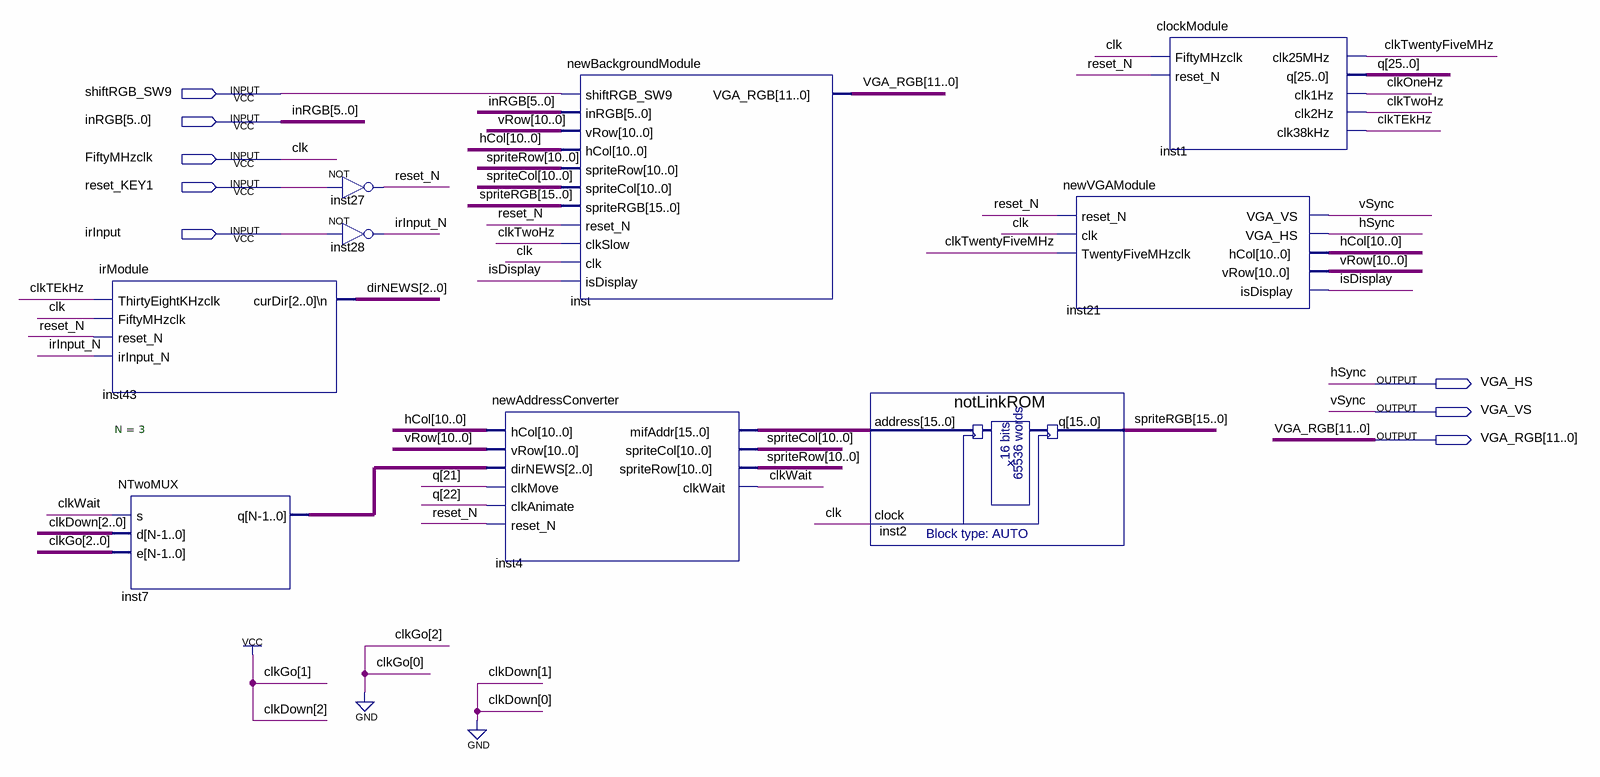
[diagram p0: schematic sheet]
// Quartus schematic DesignProjectFinal.bdf as structural Verilog: 9 symbols, 8 pins
module DesignProjectFinal (
  input  shiftRGB_SW9,
  input  [5:0] inRGB,
  input  FiftyMHzclk,
  input  reset_KEY1,
  input  irInput,
  output VGA_HS,
  output VGA_VS,
  output [11:0] VGA_RGB
);

  wire clkOneHz, clkTEkHz, clkTwentyFiveMHz, clkTwoHz, clkWait, irInput_N, isDisplay, reset_N;
  wire [2:0] dirNEWS, inst7_q;
  wire [10:0] hCol, spriteCol, spriteRow, vRow;
  wire [15:0] inst4_mifaddr, spriteRGB;
  wire [25:0] q;

  irModule inst43 (
    .ThirtyEightKHzclk(clkTEkHz), .FiftyMHzclk(FiftyMHzclk), .reset_N(reset_N), .irInput_N(irInput_N),
    .\curDir[2..0]\n (dirNEWS));
  NTwoMUX #(.N(3)) inst7 (.s(clkWait), .d(3'b100), .e(3'b010), .q(inst7_q));
  not inst27 (reset_N, reset_KEY1);
  not inst28 (irInput_N, irInput);
  newAddressConverter inst4 (
    .hCol(hCol), .vRow(vRow), .dirNEWS(inst7_q), .clkMove(q[21]), .clkAnimate(q[22]), .reset_N(reset_N),
    .mifAddr(inst4_mifaddr), .spriteCol(spriteCol), .spriteRow(spriteRow), .clkWait(clkWait));
  newBackgroundModule inst (
    .shiftRGB_SW9(shiftRGB_SW9), .inRGB(inRGB), .vRow(vRow), .hCol(hCol), .spriteRow(spriteRow),
    .spriteCol(spriteCol), .spriteRGB(spriteRGB), .reset_N(reset_N), .clkSlow(clkTwoHz), .clk(FiftyMHzclk),
    .isDisplay(isDisplay), .VGA_RGB(VGA_RGB));
  notLinkROM inst2 (.address(inst4_mifaddr), .clock(FiftyMHzclk), .q(spriteRGB));
  newVGAModule inst21 (
    .reset_N(reset_N), .clk(FiftyMHzclk), .TwentyFiveMHzclk(clkTwentyFiveMHz), .VGA_VS(VGA_VS),
    .VGA_HS(VGA_HS), .hCol(hCol), .vRow(vRow), .isDisplay(isDisplay));
  clockModule inst1 (
    .FiftyMHzclk(FiftyMHzclk), .reset_N(reset_N), .clk25MHz(clkTwentyFiveMHz), .q(q), .clk1Hz(clkOneHz),
    .clk2Hz(clkTwoHz), .clk38kHz(clkTEkHz));

  // Other names for the same wires on the sheet: clk = FiftyMHzclk; hSync = VGA_HS; vSync = VGA_VS
endmodule
